# Altium project FC.PrjPcb
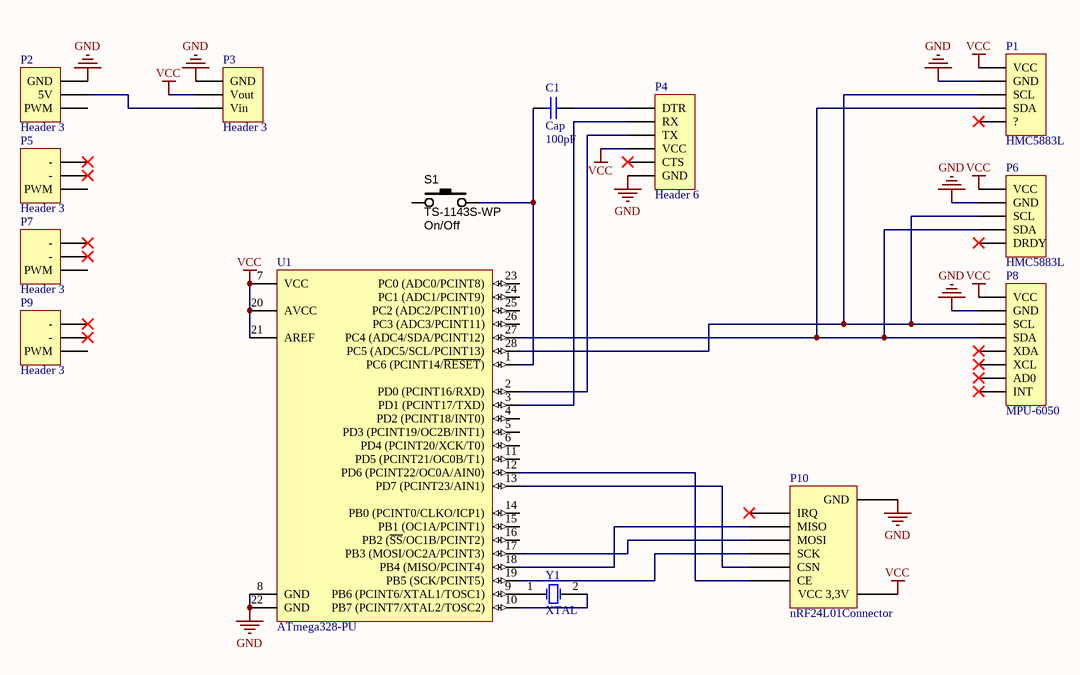
[diagram p0: FC.SchDoc]
1 sheet, 14 parts. Net scope: global (net labels, ports and power ports of the same name join across sheets).

## Sheet FC.SchDoc
size A4

### Parts
C1  Cap  value 100pF  [RAD-0.3]
P1  HMC5883L  [HDR1X5]
P2  Header 3  [HDR1X3]
P3  Header 3  [HDR1X3]
P4  Header 6  [HDR1X6]
P5  Header 3  [HDR1X3]
P6  HMC5883L  [HDR1X5]
P7  Header 3  [HDR1X3]
P8  MPU-6050  [HDR1X8]
P9  Header 3  [HDR1X3]
P10  nRF24L01Connector  [HDR2X4]
S1  TS-1143S-WP  Function: On/Off  [TS-1143S]
U1  ATmega328-PU  [28P3]
Y1  XTAL  [R38]

### Nets
GND: P1.2(GND) P2.3(GND) P3.1(GND) P4.6(GND) P6.2(GND) P8.2(GND) P10.2(GND) U1.8(GND) U1.22(GND)
VCC: P1.1(VCC) P3.2(Vout) P4.4(VCC) P6.1(VCC) P8.1(VCC) P10.1(VCC_3,3V) U1.7(VCC) U1.20(AVCC) U1.21(AREF)
NetC1_1: C1.1 S1.2 U1.1(PC6_(PCINT14/~{RESET}))
NetC1_2: C1.2 P4.1(DTR)
NetP1_3: P1.3(SCL) P6.3(SCL) P8.3(SCL) U1.28(PC5_(ADC5/SCL/PCINT13))
NetP1_4: P1.4(SDA) P6.4(SDA) P8.4(SDA) U1.27(PC4_(ADC4/SDA/PCINT12))
NetP2_2: P2.2(5V) P3.3(Vin)
NetP4_2: P4.2(RX) U1.3(PD1_(PCINT17/TXD))
NetP4_3: P4.3(TX) U1.2(PD0_(PCINT16/RXD))
NetP10_3: P10.3(CE) U1.12(PD6_(PCINT22/OC0A/AIN0))
NetP10_4: P10.4(CSN) U1.13(PD7_(PCINT23/AIN1))
NetP10_5: P10.5(SCK) U1.19(PB5_(SCK/PCINT5))
NetP10_6: P10.6(MOSI) U1.17(PB3_(MOSI/OC2A/PCINT3))
NetP10_7: P10.7(MISO) U1.18(PB4_(MISO/PCINT4))
NetU1_9: U1.9(PB6_(PCINT6/XTAL1/TOSC1)) Y1.1(OSC1)
NetU1_10: U1.10(PB7_(PCINT7/XTAL2/TOSC2)) Y1.2(OSC2)

Not connected (* = marked no-connect by the designer): P1 5(?)*; P2 1(PWM); P4 5(CTS)*; P5 1(PWM) 2(-)* 3(-)*; P6 5(DRDY)*; P7 1(PWM) 2(-)* 3(-)*; P8 5(XDA)* 6(XCL)* 7(AD0)* 8(INT)*; P9 1(PWM) 2(-)* 3(-)*; P10 8(IRQ)*; S1 1; U1 4(PD2_(PCINT18/INT0)) 5(PD3_(PCINT19/OC2B/INT1)) 6(PD4_(PCINT20/XCK/T0)) 11(PD5_(PCINT21/OC0B/T1)) 14(PB0_(PCINT0/CLKO/ICP1)) 15(PB1_(OC1A/PCINT1)) 16(PB2_(~{SS}/OC1B/PCINT2)) 23(PC0_(ADC0/PCINT8)) 24(PC1_(ADC1/PCINT9)) 25(PC2_(ADC2/PCINT10)) 26(PC3_(ADC3/PCINT11))

### Library data of the parts
C1 = Cap: Capacitor; Published: 8-Jun-2000; LatestRevisionDate: 17-Jul-2002; LatestRevisionNote: Re-released for DXP Platform.; PackageReference: RAD-0.3; Publisher: Altium Limited; PackageDescription: Radial Cap, Thru-Hole; 2 Leads; 0.3 in Pin Spacing
P1 P6 = Header 5: Header, 5-Pin; LatestRevisionDate: 17-Jul-2002; LatestRevisionNote: Re-released for DXP Platform.; Publisher: Altium Limited
P2 P3 P5 P7 P9 = Header 3: Header, 3-Pin; LatestRevisionDate: 17-Jul-2002; LatestRevisionNote: Re-released for DXP Platform.; Publisher: Altium Limited
P4 = Header 6: Header, 6-Pin; LatestRevisionDate: 17-Jul-2002; LatestRevisionNote: Re-released for DXP Platform.; Publisher: Altium Limited
P8 = Header 8: Header, 8-Pin; LatestRevisionDate: 17-Jul-2002; LatestRevisionNote: Re-released for DXP Platform.; Publisher: Altium Limited
S1 = SW_SMD_PB_4.3mm: Switch SMD Tact 4.3mm Stem; Manufacturer 1: Bond-Tact; Manufacturer Part Number 1: TS-1143S-WP-200; SCDType: spec; Package / Case: 6.5x6.5mm; 4.3mm stem
U1 = ATmega328-PU: 8-bit AVR Microcontroller, 32KB Flash, 1KB EEPROM, 2KB SRAM, 28-pin PDIP, Industrial Grade (-40°C to 85°C); Published: 1-Apr-2010; DatasheetVersion: revA, Jan-2010; PackageVersion: revB, Sep-2001; PackageReference: 28P3; Publisher: Altium Limited; PackageDescription: 28-lead (0.300"/7.62mm Wide) Plastic Dual Inline Package (PDIP); Supplier 1: Digi-Key; Supplier Part Number 1: ATMEGA328-PU-ND; Supplier 2: Mouser; Supplier Part Number 2: 556-ATMEGA328-PU; ComponentLink1Description: Manufacturer Link; ComponentLink1URL: http://www.atmel.com/products/avr/default.asp?; ComponentLink2Description: ATmega48A/48PA/88A/88PA/168A/168PA/328/328P Datasheet; ComponentLink2URL: http://www.atmel.com/dyn/resources/prod_documents/8271.pdf; ComponentLink3Description: ATmega48A/48PA/88A/88PA/168A/168PA/328/328P Summary; ComponentLink3URL: http://www.atmel.com/dyn/resources/prod_documents/8271S.pdf; ComponentLink4Description: Atmel.com Home; ComponentLink4URL: http://www.atmel.com
Y1 = XTAL: Crystal Oscillator; Published: 8-Jun-2000; LatestRevisionDate: 17-Jul-2002; LatestRevisionNote: Re-released for DXP Platform.; PackageReference: R38; Publisher: Altium Limited; PackageDescription: Crystal, Thru-Hole; 2 Leads; Body 3.1 x 8.2 mm (Dia.xH)